# Altium schematic sheet hv_psu_v100_MCU.SchDoc
size A4; SheetNumber: 3; SheetTotal: 7
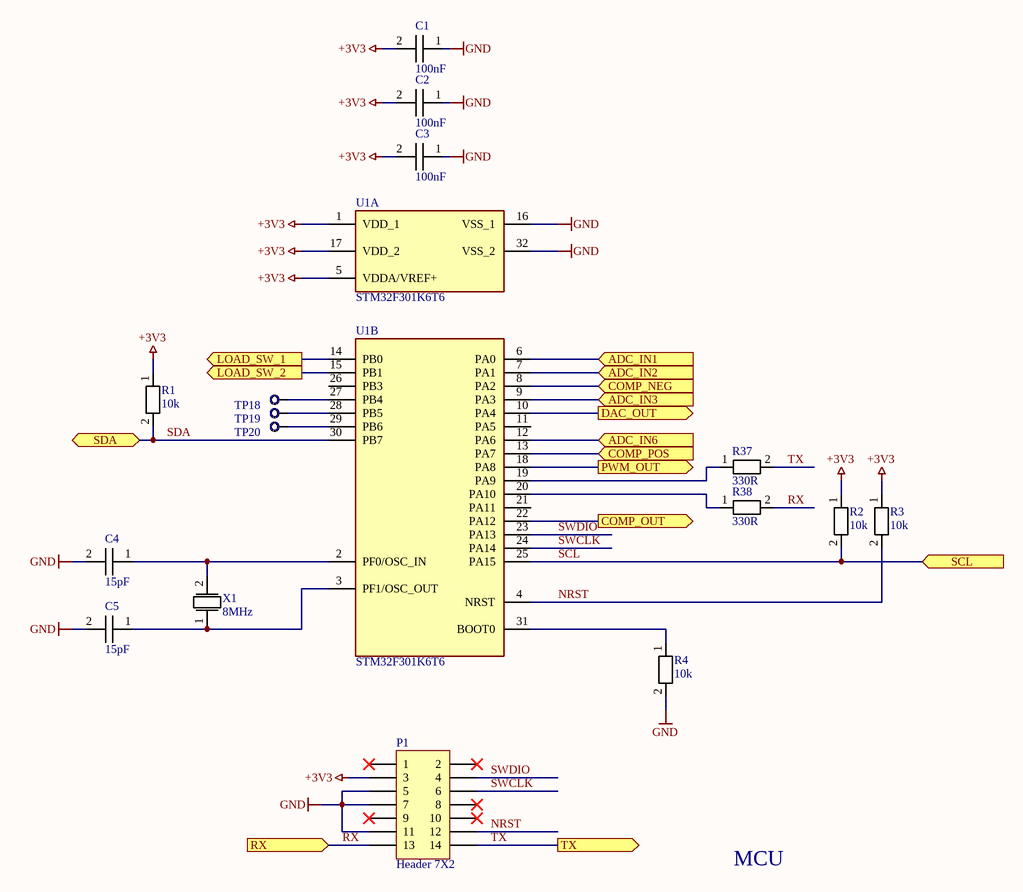
[diagram p0: hv_psu_v100_MCU.SchDoc]

## Parts
C1  100nF  [1206_C]
C2  100nF  [1206_C]
C3  100nF  [1206_C]
C4  15pF  [1206_C]
C5  15pF  [1206_C]
P1  Header 7X2  [HDR2X7]
R1  10k  [1206]
R2  10k  [1206]
R3  10k  [1206]
R4  10k  [1206]
R37  330R  [1206]
R38  330R  [1206]
TP18  ?  [PAD_40]  (value not drawn)  (no BOM)
TP19  ?  [PAD_40]  (value not drawn)  (no BOM)
TP20  ?  [PAD_40]  (value not drawn)  (no BOM)
U1  STM32F301K6T6  [QFP80P900X900X160-32N]  (parts A,B of 2)
X1  8MHz  [XTAL_SMALL]

## Ports
ADC_IN1 (in), ADC_IN2 (in), ADC_IN3 (in), ADC_IN6 (in), COMP_NEG (in), COMP_OUT (out), COMP_POS (in), DAC_OUT (out), LOAD_SW_1 (out), LOAD_SW_2 (out), PWM_OUT (out), RX (in), SCL (in), SDA (bidir), TX (out)

## Nets
+3V3: C1.2 C2.2 C3.2 P1.3 R1.1 R2.1 R3.1 U1.1(VDD_1) U1.5(VDDA/VREF+) U1.17(VDD_2)
GND: C1.1 C2.1 C3.1 C4.2 C5.2 P1.5 P1.7 P1.11 R4.2 U1.16(VSS_1) U1.32(VSS_2)
ADC_IN1: U1.6(PA0) ; port ADC_IN1
ADC_IN2: U1.7(PA1) ; port ADC_IN2
ADC_IN3: U1.9(PA3) ; port ADC_IN3
ADC_IN6: U1.12(PA6) ; port ADC_IN6
COMP_NEG: U1.8(PA2) ; port COMP_NEG
COMP_OUT: U1.22(PA12) ; port COMP_OUT
COMP_POS: U1.13(PA7) ; port COMP_POS
DAC_OUT: U1.10(PA4) ; port DAC_OUT
LOAD_SW_1: U1.14(PB0) ; port LOAD_SW_1
LOAD_SW_2: U1.15(PB1) ; port LOAD_SW_2
NRST: P1.12 R3.2 U1.4(NRST)
PWM_OUT: U1.18(PA8) ; port PWM_OUT
RX: P1.13 R38.2 ; port RX
SCL: R2.2 U1.25(PA15) ; port SCL
SDA: R1.2 U1.30(PB7) ; port SDA
SWCLK: P1.6 U1.24(PA14)
SWDIO: P1.4 U1.23(PA13)
TX: P1.14 R37.2 ; port TX
NetC4_1: C4.1 U1.2(PF0/OSC_IN) X1.2
NetC5_1: C5.1 U1.3(PF1/OSC_OUT) X1.1
NetR4_1: R4.1 U1.31(BOOT0)
NetR37_1: R37.1 U1.19(PA9)
NetR38_1: R38.1 U1.20(PA10)
NetTP18_1: TP18.1 U1.27(PB4)
NetTP19_1: TP19.1 U1.28(PB5)
NetTP20_1: TP20.1 U1.29(PB6)

Not connected (* = marked no-connect by the designer): P1 1* 2* 8* 9* 10*; U1 11(PA5) 21(PA11) 26(PB3)

## Notes on the sheet
- MCU

## Library data of the parts
C1-C5 = CAPACITOR
P1 = Header 7X2: Header, 7-Pin, Dual row; LatestRevisionDate: 17-Jul-2002; LatestRevisionNote: Re-released for DXP Platform.; Publisher: Altium Limited
R1-R4 = RESISTOR: Parameter 1: 10k
R37 R38 = RESISTOR: Parameter 1: 10k
TP18-TP20 = TESTPOINT
U1 = STM32F301K6T6: ARM Microcontrollers - MCU Mainstream Mixed signals MCUs ARM Cortex-M4 core with DSP and FPU, 64 Kbytes Flash, 72 MHz CPU, 12-bit ADC 5 MSPS, Comparator, Op-Amp; Manufacturer_Name: STMicroelectronics; Geometry.Height: 1.6mm; Manufacturer_Part_Number: STM32F301K6T6; Mouser Part Number: 511-STM32F301K6T6; Mouser Price/Stock: https://www.mouser.co.uk/ProductDetail/STMicroelectronics/STM32F301K6T6?qs=lYGu3FyN48diEpbf2nZa%2Fg%3D%3D; Arrow Part Number: STM32F301K6T6; Arrow Price/Stock: https://www.arrow.com/en/products/stm32f301k6t6/stmicroelectronics; Datasheet Link: https://componentsearchengine.com/Datasheets/1/STM32F301K6T6.pdf
X1 = XTAL